# Altium project resistance_box_PCB.PrjPcb
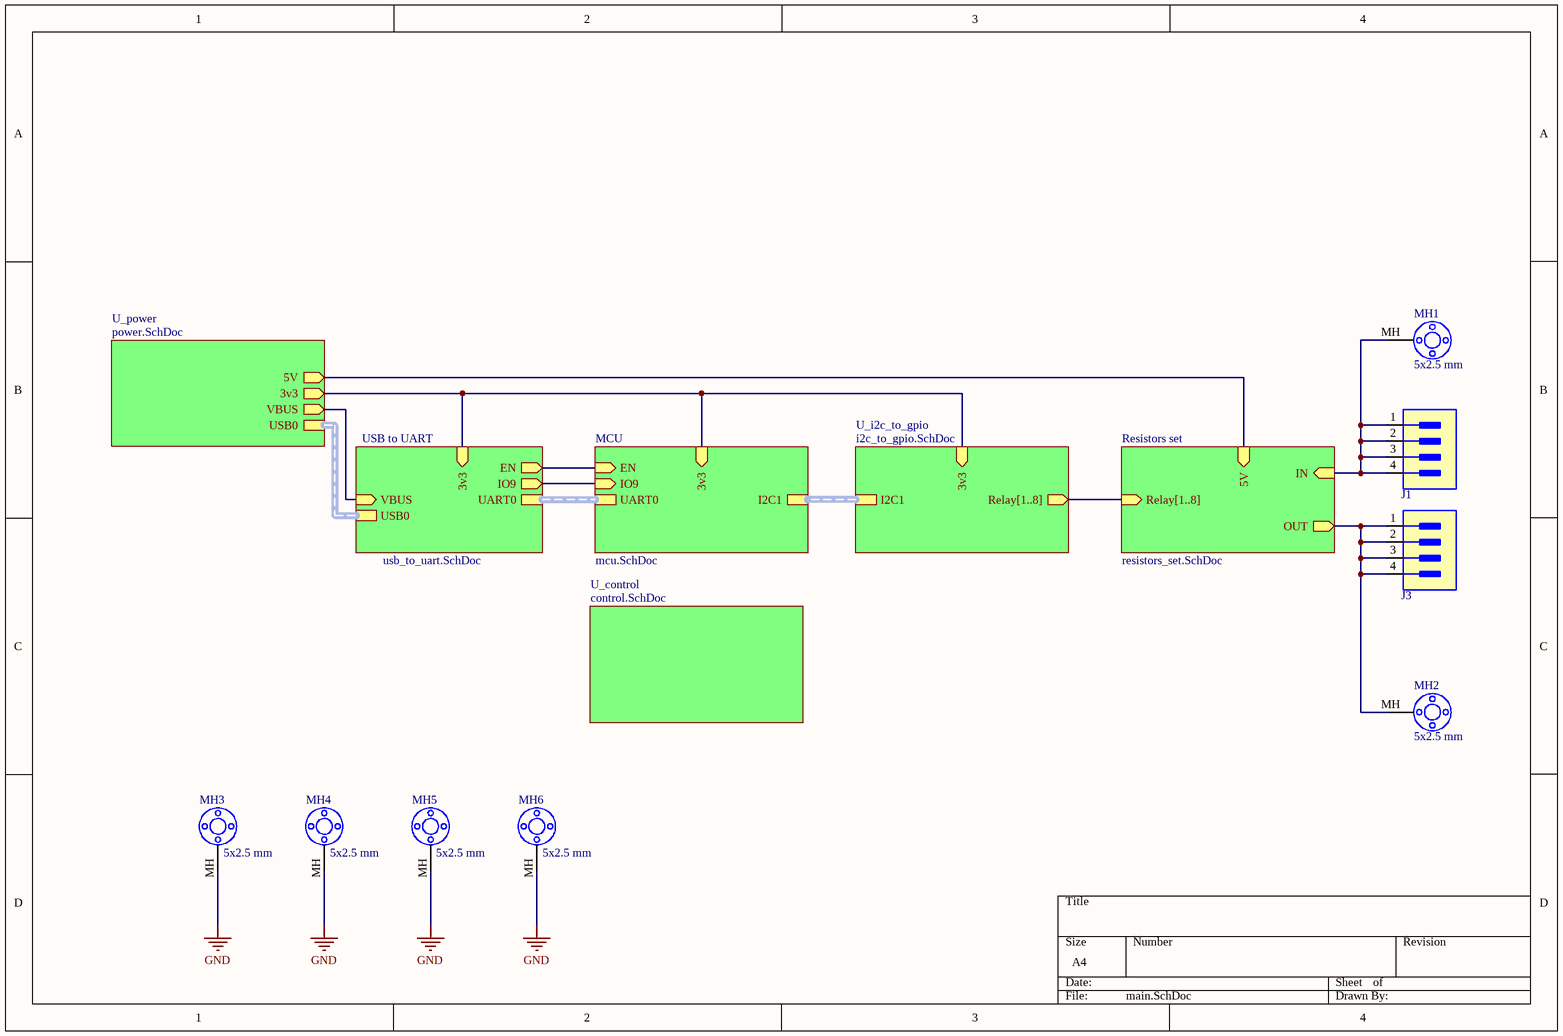
[diagram p0: main.SchDoc]
7 sheets, 83 parts. Net scope: hierarchical (ports join the sheet entries above them; power ports are global).
Board file: resistance_box_PCB.PcbDoc
Sheets:
  main.SchDoc
    Resistors set = resistors_set.SchDoc
    MCU = mcu.SchDoc
    U_power = power.SchDoc
    USB to UART = usb_to_uart.SchDoc
    U_i2c_to_gpio = i2c_to_gpio.SchDoc
    U_control = control.SchDoc

## Sheet main.SchDoc
size A4; SheetNumber: 1; SheetTotal: 7

### Parts
J1  PM254-2-02-Z-8.5  [254-2-2-Fem]  (value not drawn)
J3  PM254-2-02-Z-8.5  [254-2-2-Fem]  (value not drawn)
MH1  5x2.5 mm  [5x2m7_plated_hole]
MH2  5x2.5 mm  [5x2m7_plated_hole]
MH3  5x2.5 mm  [5x2m7_plated_hole]
MH4  5x2.5 mm  [5x2m7_plated_hole]
MH5  5x2.5 mm  [5x2m7_plated_hole]
MH6  5x2.5 mm  [5x2m7_plated_hole]

### Sub-sheets
MCU = mcu.SchDoc: 3v3 (in), I2C1, UART0, EN (in), IO9 (in)
Resistors set = resistors_set.SchDoc: IN (in), OUT (out), 5V (in), Relay[1..8] (in)
U_control = control.SchDoc: no entries
U_i2c_to_gpio = i2c_to_gpio.SchDoc: I2C1 (harness I2C), 3v3 (in), Relay[1..8] (out)
U_power = power.SchDoc: 3v3 (out), 5V (out), VBUS (out), USB0 (harness USB)
USB to UART = usb_to_uart.SchDoc: UART0 (harness UART), 3v3 (in), EN (out), IO9 (out), VBUS (in), USB0

### Nets
3v3: sheet MCU/3v3, sheet U_power/3v3, sheet USB to UART/3v3, sheet U_i2c_to_gpio/3v3
5v: sheet Resistors set/5V, sheet U_power/5V
GND: MH3.MH MH4.MH MH5.MH MH6.MH
EN: sheet MCU/EN, sheet USB to UART/EN
IO9: sheet MCU/IO9, sheet USB to UART/IO9
NetCR2_1: sheet U_power/VBUS, sheet USB to UART/VBUS
NetJ1_1: J1.1 J1.2 J1.3 J1.4 MH1.MH ; sheet Resistors set/IN
NetJ3_1: J3.1 J3.2 J3.3 J3.4 MH2.MH ; sheet Resistors set/OUT

### Buses and harness runs
bus sheet Resistors set/Relay[1..8] = sheet U_i2c_to_gpio/Relay[1..8]
harness sheet MCU/I2C1 = sheet U_i2c_to_gpio/I2C1
harness sheet MCU/UART0 = sheet USB to UART/UART0
harness sheet U_power/USB0 = sheet USB to UART/USB0

### Library data of the parts
J1 J3 = PM254-2-02-Z-8.5: 2.54mm 2.54mm 3A Copper Alloy 4P -40℃~+105℃ 260℃@5S Straight 2x2P 8.5mm Top Square Holes Plugin,P=2.54mm Female Headers ROHS; Manufacturer: HCTL; Item: Header 2.54 2x2 Female; Supplier 1: LCSC; Supplier Part Number 1: C2897403; Case: Female; Part Number: PM254-2-02-Z-8.5; HelpURL: https://datasheet.lcsc.com/lcsc/2306091005_HCTL-PM254-2-02-Z-8-5_C2897403.pdf?_gl=1*j2h43v*_ga*MTA1Mzg1NzAxMC4xNzEyNDA1NTIz*_ga_98M84MKSZH*MTcxNzc5MzMyMy44LjEuMTcxNzc5NDE5OC40My4wLjA.; Category: Headers & Wire Housings
MH1-MH6 = none: Plated hole 5x2.5 mm; Part Number: none; Item: 5x2.5 mm; Supplier: none; Case: none; Manufacturer: none; HelpURL: none

## Sheet resistors_set.SchDoc
size A4; SheetNumber: 2; SheetTotal: 6
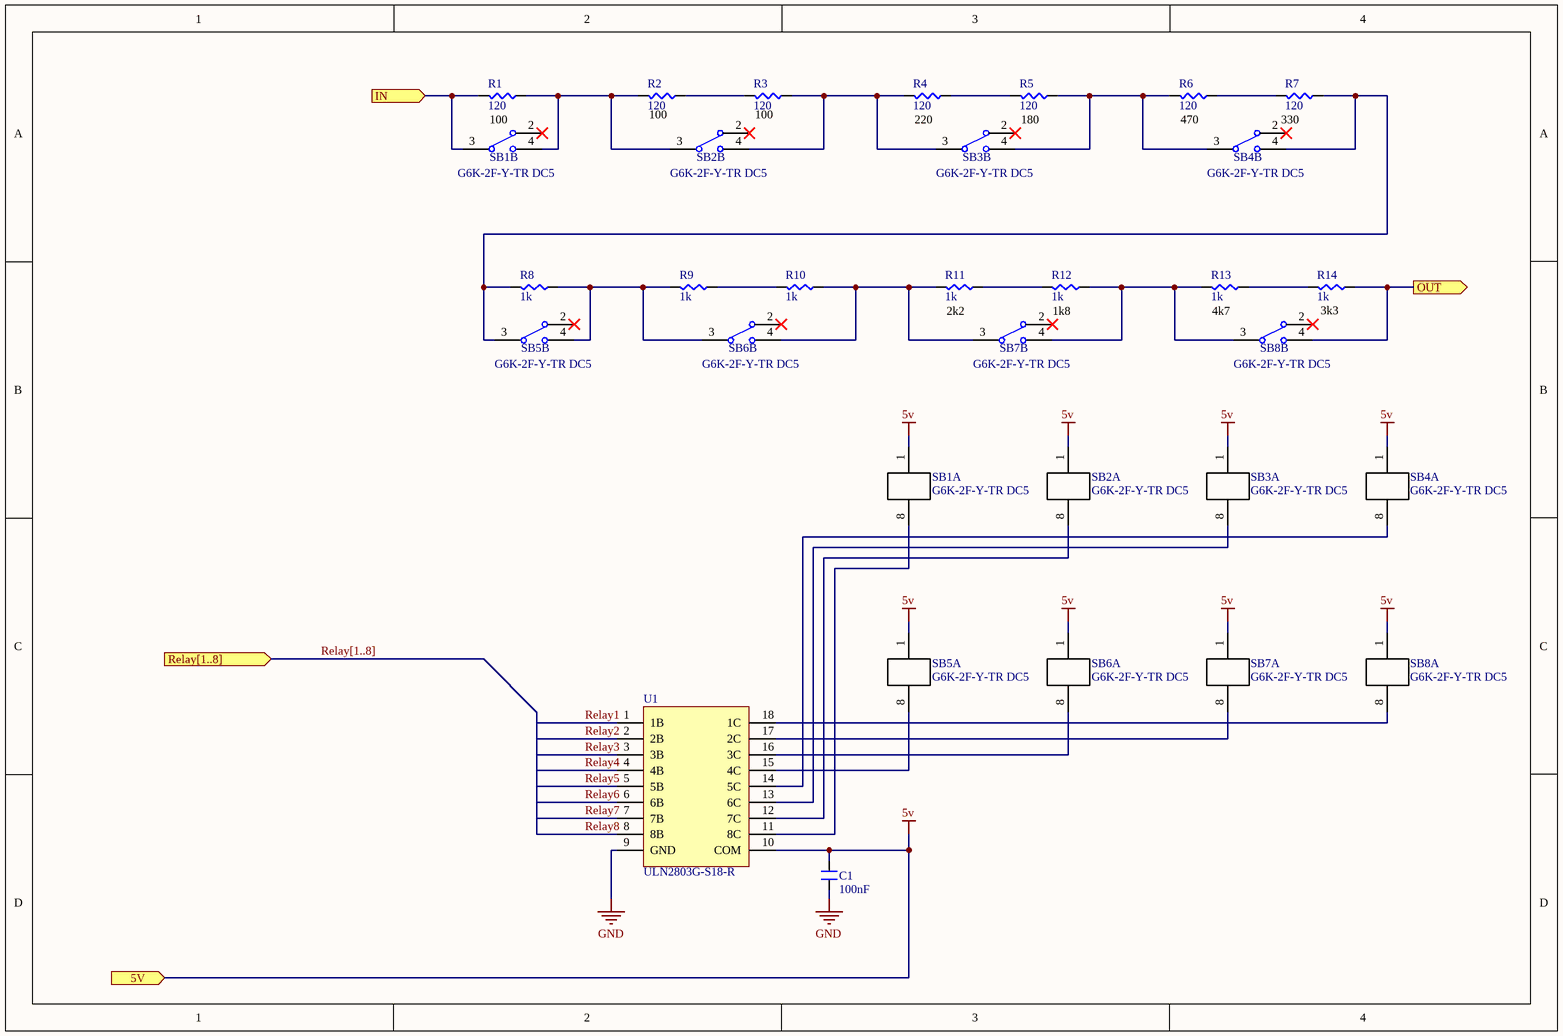
[diagram p1: resistors_set.SchDoc]

### Parts
C1  100nF  [CAP0603]
R1  120  [RES1206]
R2  120  [RES1206]
R3  120  [RES1206]
R4  120  [RES1206]
R5  120  [RES1206]
R6  120  [RES1206]
R7  120  [RES1206]
R8  1k  [RES1206]
R9  1k  [RES1206]
R10  1k  [RES1206]
R11  1k  [RES1206]
R12  1k  [RES1206]
R13  1k  [RES1206]
R14  1k  [RES1206]
SB1  G6K-2F-Y-TR DC5  [Omron_G6K-2F-Y]  (parts A,B of 3)
SB2  G6K-2F-Y-TR DC5  [Omron_G6K-2F-Y]  (parts A,B of 3)
SB3  G6K-2F-Y-TR DC5  [Omron_G6K-2F-Y]  (parts A,B of 3)
SB4  G6K-2F-Y-TR DC5  [Omron_G6K-2F-Y]  (parts A,B of 3)
SB5  G6K-2F-Y-TR DC5  [Omron_G6K-2F-Y]  (parts A,B of 3)
SB6  G6K-2F-Y-TR DC5  [Omron_G6K-2F-Y]  (parts A,B of 3)
SB7  G6K-2F-Y-TR DC5  [Omron_G6K-2F-Y]  (parts A,B of 3)
SB8  G6K-2F-Y-TR DC5  [Omron_G6K-2F-Y]  (parts A,B of 3)
U1  ULN2803G-S18-R  [SOIC-18-wide]

### Ports
5V (in), IN (in), OUT (out), Relay[1..8] (in)

### Nets
5v: C1.2 SB1.1 SB2.1 SB3.1 SB4.1 SB5.1 SB6.1 SB7.1 SB8.1 U1.10(COM) ; port 5V
GND: C1.1 U1.9(GND)
Relay1: U1.1(1B)
Relay2: U1.2(2B)
Relay3: U1.3(3B)
Relay4: U1.4(4B)
Relay5: U1.5(5B)
Relay6: U1.6(6B)
Relay7: U1.7(7B)
Relay8: U1.8(8B)
NetJ1_1: R1.1 SB1.3 ; port IN
NetJ3_1: R14.2 SB8.4 ; port OUT
NetR1_2: R1.2 R2.1 SB1.4 SB2.3
NetR2_2: R2.2 R3.1
NetR3_2: R3.2 R4.1 SB2.4 SB3.3
NetR4_2: R4.2 R5.1
NetR5_2: R5.2 R6.1 SB3.4 SB4.3
NetR6_2: R6.2 R7.1
NetR7_2: R7.2 R8.1 SB4.4 SB5.3
NetR8_2: R8.2 R9.1 SB5.4 SB6.3
NetR9_2: R9.2 R10.1
NetR10_2: R10.2 R11.1 SB6.4 SB7.3
NetR11_2: R11.2 R12.1
NetR12_2: R12.2 R13.1 SB7.4 SB8.3
NetR13_2: R13.2 R14.1
NetSB1_8: SB1.8 U1.11(8C)
NetSB2_8: SB2.8 U1.12(7C)
NetSB3_8: SB3.8 U1.13(6C)
NetSB4_8: SB4.8 U1.14(5C)
NetSB5_8: SB5.8 U1.15(4C)
NetSB6_8: SB6.8 U1.16(3C)
NetSB7_8: SB7.8 U1.17(2C)
NetSB8_8: SB8.8 U1.18(1C)

Not connected (* = marked no-connect by the designer): SB1 2*; SB2 2*; SB3 2*; SB4 2*; SB5 2*; SB6 2*; SB7 2*; SB8 2*

### Buses and harness runs
bus Relay[1..8] = port Relay[1..8]

### Notes on the sheet
- (near SB1) 100
- (near R2) 100
- (near R3) 100
- 220
- (near R5) 180
- (near R6) 470
- 330
- (near R11) 2k2
- 1k8
- 4k7
- (near R14) 3k3

### Library data of the parts
C1 = GCM188R71H104KA57J: Tolerance ±10% / Rated Voltage 50Vdc / Temperature 0±30ppm/℃; Manufacturer: Arrow Electronics; Item: 100nF 50V  ±10%; Vdc: 50V; Part Number: GCM188R71H104KA57J; Supplier 1: Mouser; Supplier Part Number 1: 81-GCM188R71H104KA7J; Case: 0603; Tolerance: 10%; Value: 100nF; HelpURL: http://www.farnell.com/datasheets/4360.pdf?src-supplier=Element14; Category: Multilayer Ceramic Capacitors - SMD/SMT
R1-R7 = CR1206-FX-1200ELF: Tolerance ±1% / Power (Watts) 0.25W, 1/4W / Temperature Coefficient ±100ppm/°C; Manufacturer: Bourns; Item: 120 ±1% 0.25W; Part Number: CR1206-FX-1200ELF; Supplier 1: Mouser; Supplier Part Number 1: 652-CR1206FX-1200ELF; Case: 1206; Tolerance: 1%; Value: 120; HelpURL: https://eu.mouser.com/datasheet/2/54/cr-1858361.pdf; Category: Thin Film Resistors - SMD
R8-R14 = CRT1206-FZ-1001ELF: Tolerance ±1% / Power (Watts) 0.1W, 1/10W / Temperature Coefficient ±50ppm/°C; Manufacturer: Bourns; Item: 1k ±1% 0.25W; Part Number: CRT1206-FZ-1001ELF; Supplier 1: Mouser; Supplier Part Number 1: 652-CRT1206FZ1001ELF; Case: 1206; Tolerance: 1%; Value: 1k; HelpURL: https://eu.mouser.com/datasheet/2/54/CRT-1649066.pdf; Category: Thin Film Resistors - SMD
SB1-SB8 = G6K-2F-Y-TR DC5: 1A 5V DPDT (2 Form C) SMD,6.5x10mm Signal Relays ROHS; Manufacturer: Omron Electronics; Part Number: G6K-2F-Y-TR DC5; Item: G6K-2F-Y-TR DC5; Supplier: LCSC; Supplier Part Number 1: C47190; Mechanical Life: N/A; Switch Function: DPDT (2 Form C); Vdss: 5V; Case: SMD,6.5x10mm; HelpURL: https://www.lcsc.com/datasheet/lcsc_datasheet_2211282300_Omron-Electronics-G6K-2F-Y-TR-DC5_C47190.pdf; Category: Relays/Signal Relays
U1 = ULN2803G-S18-R: SOP-18 Darlington Transistor Arrays ROHS; Manufacturer: UTC(Unisonic Tech); Channel: NPN; Vds: 50B; Id: 500mA; Part Number: ULN2803G-S18-R; Item: ULN2803; Supplier 1: LCSC; Supplier Part Number 1: C33924; Case: SOP-18; HelpURL: https://www.lcsc.com/datasheet/lcsc_datasheet_1810241824_UTC-Unisonic-Tech-ULN2803G-S18-R_C33924.pdf; Category: Transistors/Thyristors/Darlington Transistor Arrays

## Sheet mcu.SchDoc
size A4; SheetNumber: 3; SheetTotal: 5
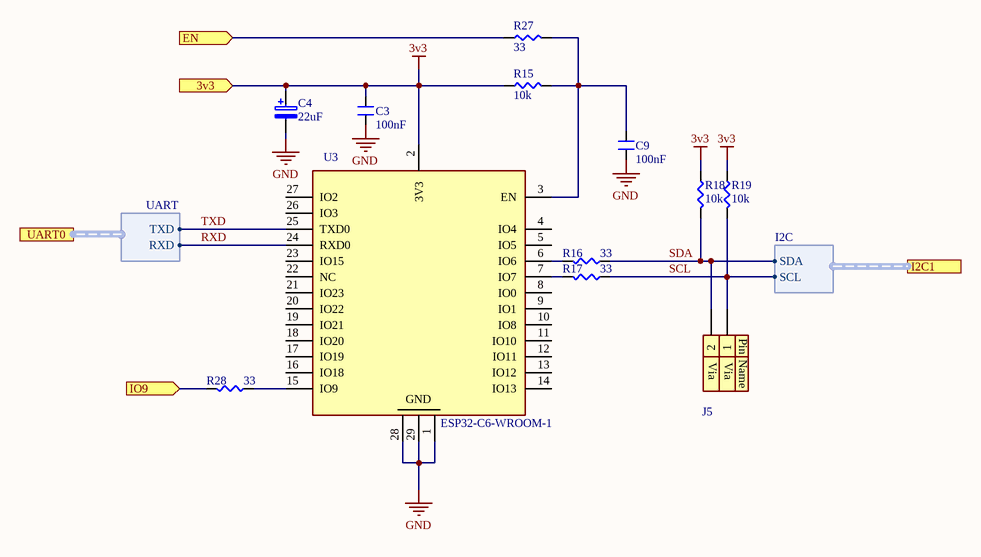
[diagram p2: mcu.SchDoc]

### Parts
C3  100nF  [CAP0603]
C4  22uF  [CAP TANT B]
C9  100nF  [CAP0603]
J5  M20-9990246  [FP-M20-9990246-MFG]  (value not drawn)
R15  10k  [RES0603]
R16  33  [RES0603]
R17  33  [RES0603]
R18  10k  [RES0603]
R19  10k  [RES0603]
R27  33  [RES0603]
R28  33  [RES0603]
U3  ESP32-C6-WROOM-1  [ESP32-C6-WROOM-1]

### Ports
3v3 (in), EN (in), I2C1 (harness I2C), IO9 (in), UART0 (harness UART)

### Harnesses
I2C: SDA, SCL
UART: TXD, RXD

### Nets
3v3: C3.2 C4.1 R15.2 R18.2 R19.2 U3.2(3V3) ; port 3v3
GND: C3.1 C4.2 C9.1 U3.1(GND) U3.28(GND) U3.29(GND)
EN: R27.2 ; port EN
IO9: R28.1 ; port IO9
RXD: U3.24(RXD0) ; port UART0.RXD
SCL: J5.1 R17.2 R19.1 ; port I2C1.SCL
SDA: J5.2 R16.2 R18.1 ; port I2C1.SDA
TXD: U3.25(TXD0) ; port UART0.TXD
NetC9_2: C9.2 R15.1 R27.1 U3.3(EN)
NetR16_1: R16.1 U3.6(IO6)
NetR17_1: R17.1 U3.7(IO7)
NetR28_2: R28.2 U3.15(IO9)

Not connected (* = marked no-connect by the designer): U3 4(IO4) 5(IO5) 8(IO0) 9(IO1) 10(IO8) 11(IO10) 12(IO11) 13(IO12) 14(IO13) 16(IO18) 17(IO19) 18(IO20) 19(IO21) 20(IO22) 21(IO23) 22(NC) 23(IO15) 26(IO3) 27(IO2)

### Notes on the sheet
- (in symbol M20-9990246) Pin; Via; Name

### Library data of the parts
C3 C9 = GCM188R71H104KA57J: as C1 on sheet resistors_set; Part Number: GCM188R71H104KA57J; Supplier 1: Mouser; Supplier Part Number 1: 81-GCM188R71H104KA7J; Case: 0603; Tolerance: 10%; Value: 100nF; HelpURL: http://www.farnell.com/datasheets/4360.pdf?src-supplier=Element14; Category: Multilayer Ceramic Capacitors - SMD/SMT
C4 = TAJB226K016RNJ: Tolerance ±10% / Type Molded / ESR (Equivalent Series Resistance) 2,3Ohm / Operating Temperature -55°C ~ 125°C; Manufacturer: KYOCERA AVX; Item: 22uF 16V ±10%; Vdc: 16V; Part Number: TAJB226K016RNJ; Supplier 1: Mouser; Supplier Part Number 1: 581-TAJB226K016; Case: Manufacturer Size Code B; Tolerance: 10%; Value: 22uF; HelpURL: https://eu.mouser.com/datasheet/2/40/TAJ-3165264.pdf; Category: Tantalum Capacitors - Solid SMD
J5 = M20-9990246: CONN HEADER VERT 2POS 2.54MM; Manufacturer: Harwin; Conn Gender: Male; Supplier 1: Digi-Key; Supplier Part Number 1: 952-2262-ND; Case: Male; Part Number: M20-9990246; Item: CMP-15831-000009-1; HelpURL: https://cdn.harwin.com/pdfs/M20-999.pdf?src-supplier=Element14
R15 R18 R19 = CR0603-FX-1002ELF: Tolerance ±1% / Power (Watts) 0.1W, 1/10W / Temperature Coefficient ±100ppm/°C; Manufacturer: Bourns; Item: 10k  ±1% 0.1W; Part Number: CR0603-FX-1002ELF; Supplier 1: Mouser; Supplier Part Number 1: 652-CR0603FX-1002ELF; Case: 0603; Tolerance: 1%; Value: 10k; HelpURL: https://eu.mouser.com/datasheet/2/54/cr-1858361.pdf; Category: Thin Film Resistors - SMD
R16 R17 R27 R28 = CR0603FX-33R0ELF: Tolerance ±1% / Power (Watts) 0.1W, 1/10W / Temperature Coefficient ±100ppm/°C; Manufacturer: Bourns; Item: 33  ±1% 0.1W; Part Number: CR0603FX-33R0ELF; Supplier 1: Mouser; Supplier Part Number 1: 652-CR0603FX-33R0ELF; Case: 0603; Tolerance: 1%; Value: 33; HelpURL: https://eu.mouser.com/datasheet/2/54/crxxxxx-1858361.pdf; Category: Thin Film Resistors - SMD
U3 = ESP32-C6-WROOM-1: ESP32-C6 module, Wi-Fi 6 in 2.4 GHz band, Bluetooth 5, Zigbee 3.0 and Thread. ESP34-WROOM Compatible; Manufacturer: Espressif Systems; Interfaces: GPIO, SPI, UART, I2C, I2S, RMT; Vdss: 3.3V; Part Number: ESP32-C6-WROOM-1; Item: ESP32-C6-WROOM-1; Supplier 1: Aliexpress; Supplier Part Number 1: ESP32-C6-WROOM-1; Case: Development Boards; HelpURL: https://www.espressif.com/sites/default/files/documentation/esp32-c6-wroom-1_wroom-1u_datasheet_en.pdf; Category: Multiprotocol Modules

## Sheet power.SchDoc
size A4; SheetNumber: 4; SheetTotal: 5
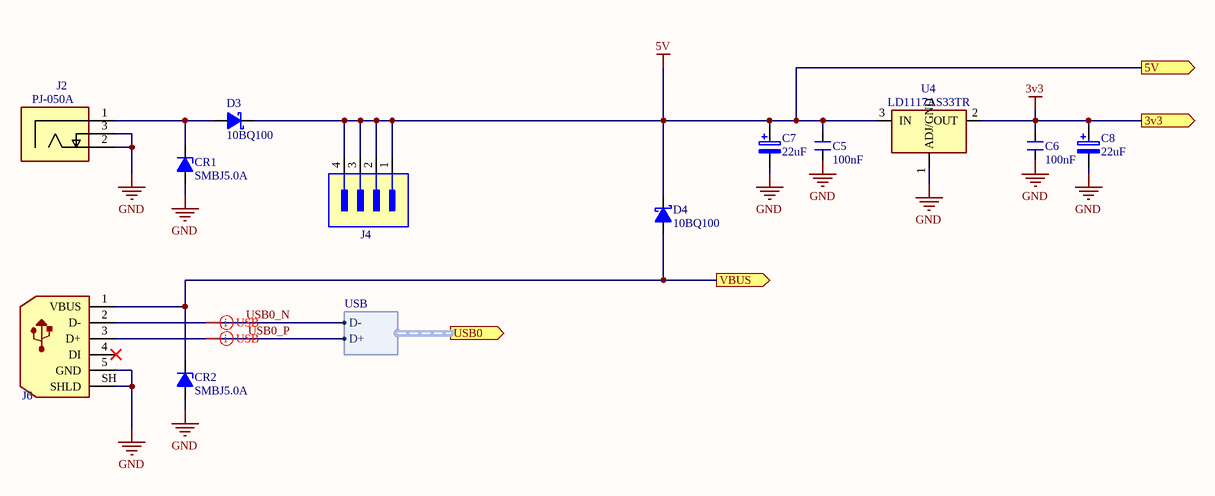
[diagram p3: power.SchDoc]

### Parts
C5  100nF  [CAP0603]
C6  100nF  [CAP0603]
C7  22uF  [CAP TANT B]
C8  22uF  [CAP TANT B]
CR1  SMBJ5.0A  [DO-214AA-2_SMB]
CR2  SMBJ5.0A  [DO-214AA-2_SMB]
D3  10BQ100  [DO-214AA-2_SMB]
D4  10BQ100  [DO-214AA-2_SMB]
J2  PJ-050A  [CUI_PJ050A]
J4  PM254-2-02-Z-8.5  [254-2-2-Fem]  (value not drawn)
J6  micro-USB female  [GCT_USB_Micro_B]  (value not drawn)
U4  LD1117AS33TR  [SOT-223]

### Ports
3v3 (out), 5V (out), USB0 (out, harness USB), VBUS (out)

### Harnesses
USB: D-, D+

### Nets
3v3: C6.2 C8.1 U4.2(OUT) ; port 3v3
5v: C5.2 C7.1 D3.1(C) D4.1(C) J4.1 J4.2 J4.3 J4.4 U4.3(IN) ; port 5V
GND: C5.1 C6.1 C7.2 C8.2 CR1.2(A) CR2.2(A) J2.2 J2.3 J6.5(GND) J6.SH(SHLD) U4.1(ADJ/GND)
USB0_N: J6.2(D-) ; port USB0.D-
USB0_P: J6.3(D+) ; port USB0.D+
NetCR1_1: CR1.1(C) D3.2(A) J2.1
NetCR2_1: CR2.1(C) D4.2(A) J6.1(VBUS) ; port VBUS

Not connected (* = marked no-connect by the designer): J6 4(DI)*

### Layout directives
differential pair; differential pair class USB: USB0_N, USB0_P

### Library data of the parts
C5 C6 = GCM188R71H104KA57J: as C1 on sheet resistors_set; Part Number: GCM188R71H104KA57J; Supplier 1: Mouser; Supplier Part Number 1: 81-GCM188R71H104KA7J; Case: 0603; Tolerance: 10%; Value: 100nF; HelpURL: http://www.farnell.com/datasheets/4360.pdf?src-supplier=Element14; Category: Multilayer Ceramic Capacitors - SMD/SMT
C7 C8 = TAJB226K016RNJ: as C4 on sheet mcu; Part Number: TAJB226K016RNJ; Supplier 1: Mouser; Supplier Part Number 1: 581-TAJB226K016; Case: Manufacturer Size Code B; Tolerance: 10%; Value: 22uF; HelpURL: https://eu.mouser.com/datasheet/2/40/TAJ-3165264.pdf; Category: Tantalum Capacitors - Solid SMD
CR1 CR2 = SMBJ5.0A: ESD Suppressors / TVS Diodes 600W 5V Unidirect; Manufacturer: Bourns; Item: SMBJ5.0A; Part Number: SMBJ5.0A; Supplier 1: Mouser; Vdss: 5V; Case: DO-214AA-2; HelpURL: https://eu.mouser.com/datasheet/2/54/smbj-778392.pdf; Category: ESD Suppressors / TVS Diodes
D3 D4 = 10BQ100: Schottky Diodes & Rectifiers 1A 100V Single Die Schottky Rectifier; Manufacturer: Hottech; Type: Diode Schottky; Id: 1А; Part Number: 10BQ100; Item: 10BQ100; Supplier 1: ChipDip; Supplier Part Number 1: 9000970121; Vdss: 100V; Case: DO-214AA-2; HelpURL: https://static.chipdip.ru/lib/751/DOC015751074.pdf; Category: Schottky Diodes & Rectifiers
J2 = PJ-050A: DC Power Connectors Power Jacks Right Angle; Manufacturer Part Number: MJ-2506N; Manufacturer: CUI Devices; Supplier 1: Mouser; Supplier Part Number 1: 490-PJ-050A; Part Number: PJ-050A; Item: PJ-050A; Case: Female; HelpURL: https://eu.mouser.com/datasheet/2/670/pj_050a-1778816.pdf; Category: DC Power Connectors
J4 = PM254-2-02-Z-8.5: as J1 on sheet main; Supplier 1: LCSC; Supplier Part Number 1: C2897403; Case: Female; Part Number: PM254-2-02-Z-8.5; HelpURL: https://datasheet.lcsc.com/lcsc/2306091005_HCTL-PM254-2-02-Z-8-5_C2897403.pdf?_gl=1*j2h43v*_ga*MTA1Mzg1NzAxMC4xNzEyNDA1NTIz*_ga_98M84MKSZH*MTcxNzc5MzMyMy44LjEuMTcxNzc5NDE5OC40My4wLjA.; Category: Headers & Wire Housings
J6 = 640-USB3076-30-A: USB Connectors Micro B Skt, Bottom-SMT, R/A, 30u, No Peg, W/shell stake, No MEF,T&R; Manufacturer: GCT; Item: USB-Micro; Part Number: 640-USB3076-30-A; Supplier 1: Mouser; Case: Female; HelpURL: https://eu.mouser.com/datasheet/2/837/USB3076-2888220.pdf; Category: USB Connectors
U4 = LD1117AS33TR: Linear Voltage Regulators 3.3V 1A Positive; Manufacturer: STMicroelectronics; Output Voltage: 3,3; Input Voltage, Max: 10; Part Number: LD1117AS33TR; Item: LD1117A; Supplier 1: Chipdip; Supplier Part Number 1: LD1117AS33TR; Case: SOT-223; HelpURL: https://static.chipdip.ru/lib/918/DOC012918569.pdf; Category: Linear Voltage Regulators; Output Current: 1 A

## Sheet usb_to_uart.SchDoc
size A4; SheetNumber: 5; SheetTotal: 6
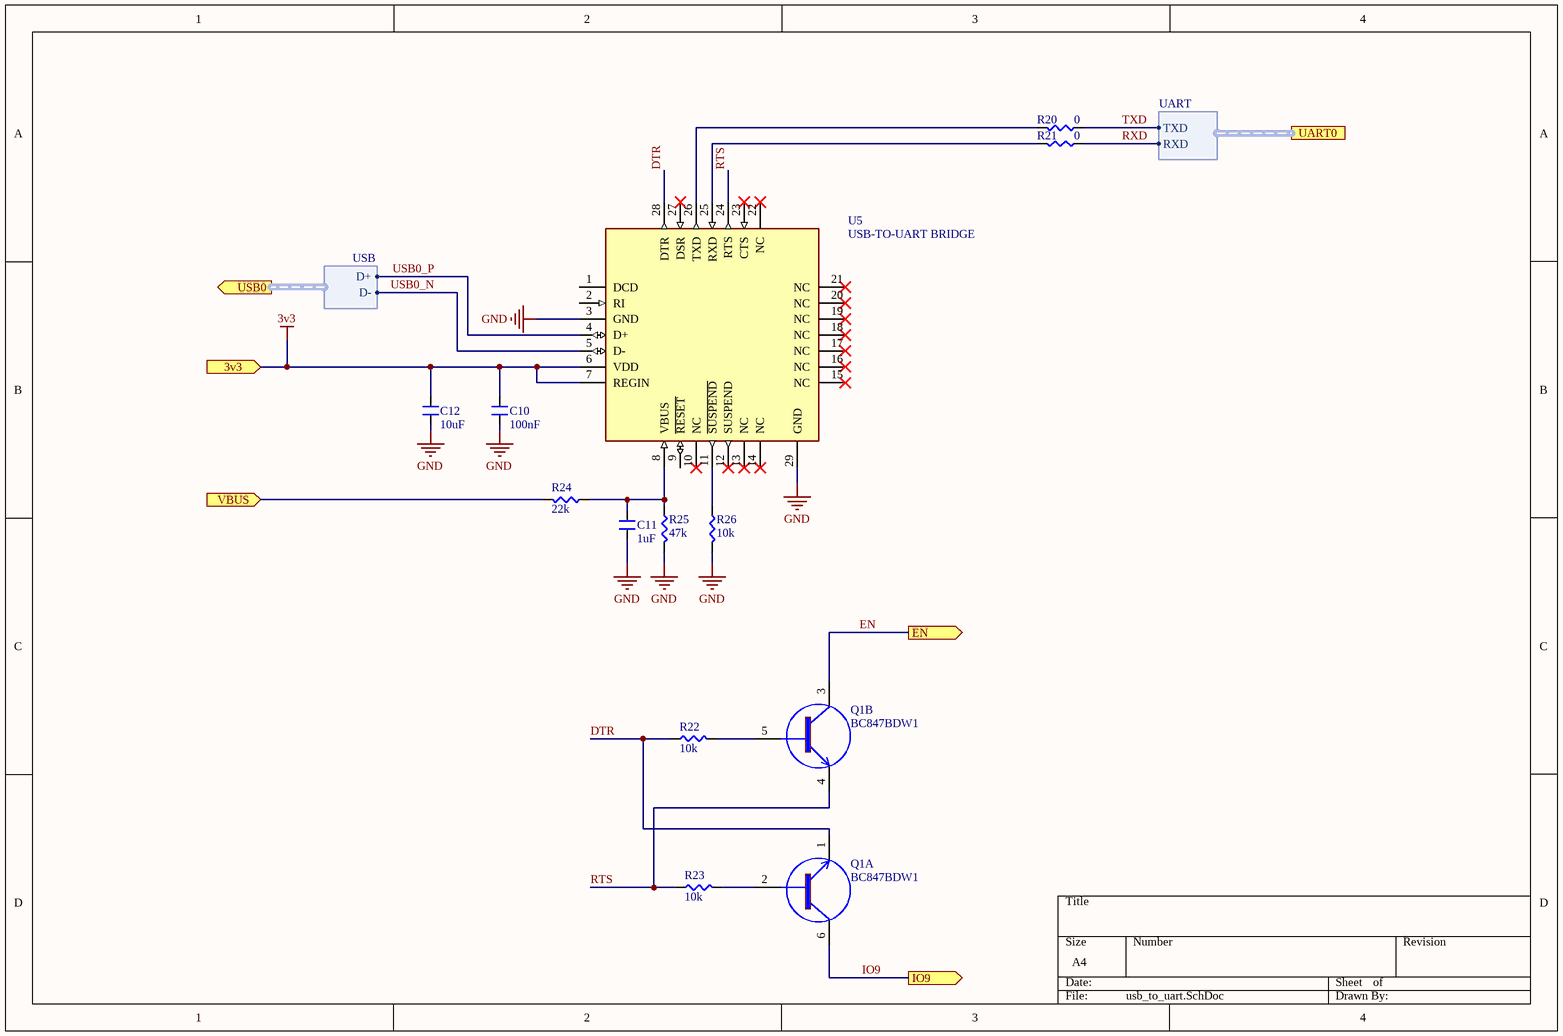
[diagram p4: usb_to_uart.SchDoc]

### Parts
C10  100nF  [CAP0603]
C11  1uF  [CAP1206_38MIL]
C12  10uF  [CAP1206_63MIL]
Q1  BC847BDW1  [SOT-363]  (parts A,B of 2)
R20  0  [RES0603]
R21  0  [RES0603]
R22  10k  [RES0603]
R23  10k  [RES0603]
R24  22k  [RES0603]
R25  47k  [RES0603]
R26  10k  [RES0603]
U5  USB-TO-UART BRIDGE  [QFN50P480X480X80_HS-29N]

### Ports
3v3 (in), EN (out), IO9 (out), UART0 (harness UART), USB0 (out, harness USB), VBUS (in)

### Harnesses
UART: TXD, RXD
USB: D-, D+

### Nets
3v3: C10.2 C12.2 U5.6(VDD) U5.7(REGIN) ; port 3v3
GND: C10.1 C11.1 C12.1 R25.1 R26.1 U5.3(GND) U5.29(GND)
DTR: Q1.1(E2) R22.2 U5.28(DTR)
EN: Q1.3(C2) ; port EN
IO9: Q1.6(C2) ; port IO9
RTS: Q1.4(E2) R23.2 U5.24(RTS)
RXD: R21.2 ; port UART0.RXD
TXD: R20.2 ; port UART0.TXD
USB0_N: U5.5(D-) ; port USB0.D-
USB0_P: U5.4(D+) ; port USB0.D+
NetC11_2: C11.2 R24.2 R25.2 U5.8(VBUS)
NetCR2_1: R24.1 ; port VBUS
NetQ1_2: Q1.2(B2) R23.1
NetQ1_5: Q1.5(B2) R22.1
NetR20_1: R20.1 U5.26(TXD)
NetR21_1: R21.1 U5.25(RXD)
NetR26_2: R26.2 U5.11(~{SUSPEND})

Not connected (* = marked no-connect by the designer): U5 1(DCD) 2(RI) 9(~{RESET}) 10(NC)* 12(SUSPEND)* 13(NC)* 14(NC)* 15(NC)* 16(NC)* 17(NC)* 18(NC)* 19(NC)* 20(NC)* 21(NC)* 22(NC)* 23(CTS)* 27(DSR)*

### Library data of the parts
C10 = GCM188R71H104KA57J: as C1 on sheet resistors_set; Part Number: GCM188R71H104KA57J; Supplier 1: Mouser; Supplier Part Number 1: 81-GCM188R71H104KA7J; Case: 0603; Tolerance: 10%; Value: 100nF; HelpURL: http://www.farnell.com/datasheets/4360.pdf?src-supplier=Element14; Category: Multilayer Ceramic Capacitors - SMD/SMT
C11 = C1206X105K5RECAUTO: Tolerance ±10% / Rated Voltage 50Vdc / Dielectric:  X7R; Manufacturer: KEMET; Item: 1uF 50V ±10%; Vdc: 50V; Tolerance: 0,1; Part Number: C1206X105K5RECAUTO; Supplier 1: Mouser; Case: 1206; Value: 1uF; HelpURL: https://eu.mouser.com/datasheet/2/212/1/KEM_C1090_X7R_ESD-1103328.pdf
C12 = GRT31CR61H106ME01L: Tolerance ±20% / Voltage - Rated 50V; Manufacturer: Murata; Item: 10uF 50V ±20%; Tolerance: 0,2; Part Number: GRT31CR61H106ME01L; Supplier 1: Mouser; Supplier Part Number 1: 81-GRT31CR61H106ME1L; Case: 1206; Vdc: 50V; Value: 10uF; HelpURL: https://eu.mouser.com/datasheet/2/281/GRT31CR61H106ME01-01-1065064.pdf; Category: Multilayer Ceramic Capacitors - SMD/SMT
Q1 = BC847BDW1: 45V 380mW 200@2mA,5V 100mA NPN SOT-363 Bipolar Transistors - BJT ROHS; Manufacturer: onsemi; Vds: 45B; Part Number: BC847BDW1; Item: BC847BDW1; Supplier 1: LCSC; Supplier Part Number 1: C513269; Channel: NPN; Case: SOT-363; HelpURL: https://www.lcsc.com/datasheet/lcsc_datasheet_2004241034_onsemi-BC847BDW1T3G_C513269.pdf; Category: Transistors/Thyristors/Darlington Transistor Arrays
R20 R21 = AF0603JR-070RL: Tolerance ±1% / Power (Watts) 0.1W, 1/10W / Temperature Coefficient ±100ppm/°C; Manufacturer: YAGEO; Item: 0 ±1% 0.1W; Part Number: AF0603JR-070RL; Supplier 1: Mouser; Supplier Part Number 1: 603-AF0603JR-070RL; Case: 0603; Tolerance: 1%; Value: 0; HelpURL: https://eu.mouser.com/datasheet/2/447/PYu_AF_51_RoHS_L_8-3003045.pdf; Category: Thin Film Resistors - SMD
R22 R23 R26 = CR0603-FX-1002ELF: as R15 on sheet mcu; Part Number: CR0603-FX-1002ELF; Supplier 1: Mouser; Supplier Part Number 1: 652-CR0603FX-1002ELF; Case: 0603; Tolerance: 1%; Value: 10k; HelpURL: https://eu.mouser.com/datasheet/2/54/cr-1858361.pdf; Category: Thin Film Resistors - SMD
R24 = CR0603-FX-2202ELF: Tolerance ±1% / Power (Watts) 0.1W, 1/10W / Temperature Coefficient ±100ppm/°C; Manufacturer: Bourns; Item: 22k ±1% 0.1W; Part Number: CR0603-FX-2202ELF; Supplier 1: Mouser; Supplier Part Number 1: 652-CR0603FX-2202ELF; Case: 0603; Tolerance: 1%; Value: 22k; HelpURL: https://www.mouser.com/datasheet/2/54/cr-1858361.pdf; Category: Thin Film Resistors - SMD
R25 = ERJ-3EKF4702V: Tolerance ±1% / Power (Watts) 0.1W, 1/10W / Temperature Coefficient ±100ppm/°C; Manufacturer: Panasonic; Item: 47k ±1% 0.1W; Part Number: ERJ-3EKF4702V; Supplier 1: Mouser; Supplier Part Number 1: 667-ERJ-3EKF4702V; Case: 0603; Tolerance: 1%; Value: 47k; HelpURL: https://www.mouser.com/datasheet/2/315/AOA0000C304-1149620.pdf; Category: Thin Film Resistors - SMD
U5 = CP2102: Voltage - Supply 3V ~ 3.6V / Current - Supply 20mA / Standards USB 2.0; Manufacturer: Silicon Lab; Part Number: CP2102; Supplier 1: Digi-Key; Supplier Part Number 1: 336-1160-1-ND; Case: QFN-28; Item: CP2102; HelpURL: https://www.silabs.com/documents/public/errata/CP2102Berrata.pdf?src-supplier=Digi-Key; Category: USB to UART Interface IC

## Sheet i2c_to_gpio.SchDoc
size A4; SheetNumber: 6; SheetTotal: 6
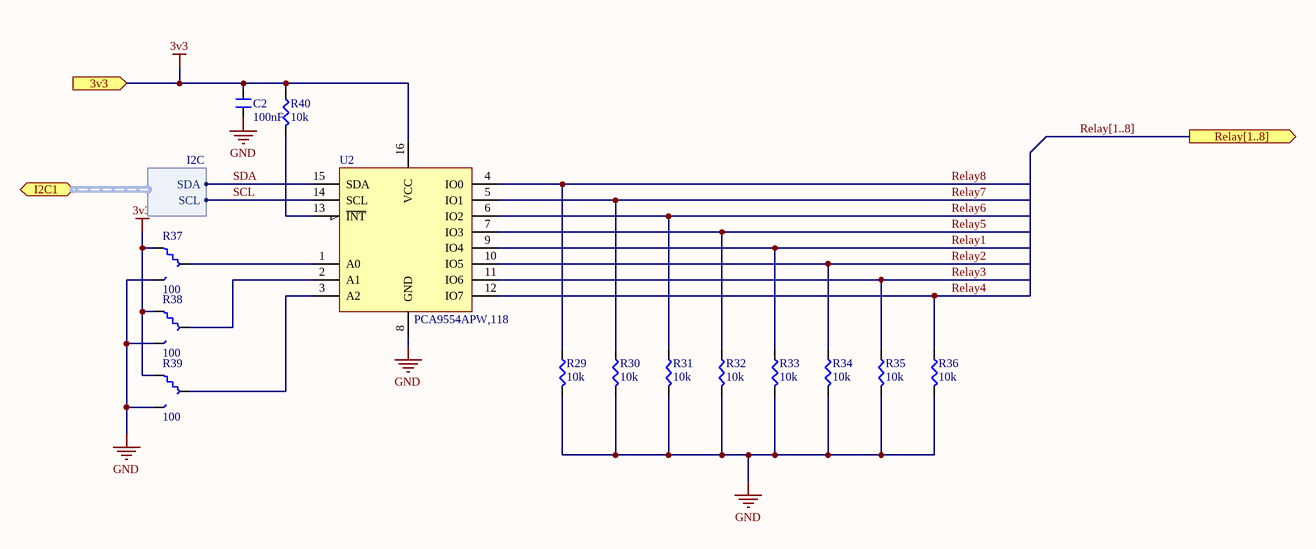
[diagram p5: i2c_to_gpio.SchDoc]

### Parts
C2  100nF  [CAP0603]
R29  10k  [RES0603]
R30  10k  [RES0603]
R31  10k  [RES0603]
R32  10k  [RES0603]
R33  10k  [RES0603]
R34  10k  [RES0603]
R35  10k  [RES0603]
R36  10k  [RES0603]
R37  100  [RES0603_CHANGE]
R38  100  [RES0603_CHANGE]
R39  100  [RES0603_CHANGE]
R40  10k  [RES0603]
U2  PCA9554APW,118  [TSSOP16]

### Ports
3v3 (in), I2C1 (bidir, harness I2C), Relay[1..8] (out)

### Harnesses
I2C: SDA, SCL

### Nets
3v3: C2.2 R37.1 R38.1 R39.1 R40.1 U2.16(VCC) ; port 3v3
GND: C2.1 R29.2 R30.2 R31.2 R32.2 R33.2 R34.2 R35.2 R36.2 R37.3 R38.3 R39.3 U2.8(GND)
Relay1: R33.1 U2.9(IO4)
Relay2: R34.1 U2.10(IO5)
Relay3: R35.1 U2.11(IO6)
Relay4: R36.1 U2.12(IO7)
Relay5: R32.1 U2.7(IO3)
Relay6: R31.1 U2.6(IO2)
Relay7: R30.1 U2.5(IO1)
Relay8: R29.1 U2.4(IO0)
SCL: U2.14(SCL) ; port I2C1.SCL
SDA: U2.15(SDA) ; port I2C1.SDA
NetR37_2: R37.2 U2.1(A0)
NetR38_2: R38.2 U2.2(A1)
NetR39_2: R39.2 U2.3(A2)
NetR40_2: R40.2 U2.13(~{INT})

### Buses and harness runs
bus Relay[1..8] = port Relay[1..8]

### Library data of the parts
C2 = GCM188R71H104KA57J: as C1 on sheet resistors_set; Part Number: GCM188R71H104KA57J; Supplier 1: Mouser; Supplier Part Number 1: 81-GCM188R71H104KA7J; Case: 0603; Tolerance: 10%; Value: 100nF; HelpURL: http://www.farnell.com/datasheets/4360.pdf?src-supplier=Element14; Category: Multilayer Ceramic Capacitors - SMD/SMT
R29-R36 R40 = CR0603-FX-1002ELF: as R15 on sheet mcu; Part Number: CR0603-FX-1002ELF; Supplier 1: Mouser; Supplier Part Number 1: 652-CR0603FX-1002ELF; Case: 0603; Tolerance: 1%; Value: 10k; HelpURL: https://eu.mouser.com/datasheet/2/54/cr-1858361.pdf; Category: Thin Film Resistors - SMD
R37-R39 = ERJ-3EKF9101V (Jump_RES): Tolerance ±1% / Power (Watts) 0.1W, 1/10W / Temperature Coefficient ±100ppm/°C; Manufacturer: Panasonic; Item: 100 ±1% 0.1W (Jump_RES); Part Number: ERJ-3EKF9101V (Jump_RES); Supplier 1: Mouser; Supplier Part Number 1: 667-ERJ-3EKF9101V; Case: 0603; Tolerance: 1%; Value: 100; HelpURL: https://eu.mouser.com/datasheet/2/315/AOA0000C304-1149620.pdf; Category: Thin Film Resistors - SMD
U2 = PCA9554APW,118: Interface - I/O Expander I2C I/O; Manufacturer: NXP; Part Number: PCA9554APW,118; Item: PCA9554APW,118; Supplier 1: Mouser; Supplier Part Number 1: 771-PCA9554APW-T; Case: 16-TSSOP; HelpURL: https://eu.mouser.com/datasheet/2/302/PCA9554_9554A-1127609.pdf; Category: I/O Expanders

## Sheet control.SchDoc
size A4; SheetNumber: 7; SheetTotal: 7
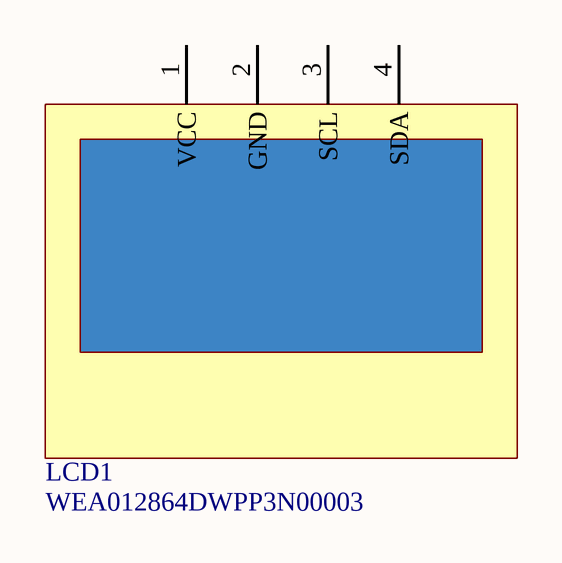
[diagram p6: control.SchDoc]

### Parts
LCD1  WEA012864DWPP3N00003  [WEA012864DWPP3N00003]

### Nets

Not connected (* = marked no-connect by the designer): LCD1 1(VCC) 2(GND) 3(SCL) 4(SDA)

### Library data of the parts
LCD1 = WEA012864DWPP3N00003: OLED 0.96" display, 128x64, white,  IC SSD1306BZ, I2C, 3v, -40...+80°С; Manufacturer: Winstar; Part Number: WEA012864DWPP3N00003; Item: WEA012864DWPP3N00003; Supplier 1: ChipDip; Supplier Part Number 1: 8001808254; Case: none; HelpURL: https://www.compel.ru/item-pdf/bf9bb7bf1ce7223b4efcb84e5467b96d/pn/winstar~wea012864dwpp3n00003.pdf; Category: OLED displays

## Nets that join several sheets
3v3: mcu (6 pins), power (C6.2 C8.1 U4.2), usb_to_uart (C10.2 C12.2 U5.6 U5.7), i2c_to_gpio (6 pins)
5v: resistors_set (10 pins), power (9 pins)
GND: main (MH3.MH MH4.MH MH5.MH MH6.MH), resistors_set (C1.1 U1.9), mcu (6 pins), power (11 pins), usb_to_uart (7 pins), i2c_to_gpio (13 pins)
EN: mcu (R27.2), usb_to_uart (Q1.3)
IO9: mcu (R28.1), usb_to_uart (Q1.6)
NetCR2_1: power (CR2.1 D4.2 J6.1), usb_to_uart (R24.1)
NetJ1_1: main (5 pins), resistors_set (R1.1 SB1.3)
NetJ3_1: main (5 pins), resistors_set (R14.2 SB8.4)
Relay1: resistors_set (U1.1), i2c_to_gpio (R33.1 U2.9)
Relay2: resistors_set (U1.2), i2c_to_gpio (R34.1 U2.10)
Relay3: resistors_set (U1.3), i2c_to_gpio (R35.1 U2.11)
Relay4: resistors_set (U1.4), i2c_to_gpio (R36.1 U2.12)
Relay5: resistors_set (U1.5), i2c_to_gpio (R32.1 U2.7)
Relay6: resistors_set (U1.6), i2c_to_gpio (R31.1 U2.6)
Relay7: resistors_set (U1.7), i2c_to_gpio (R30.1 U2.5)
Relay8: resistors_set (U1.8), i2c_to_gpio (R29.1 U2.4)
RXD: mcu (U3.24), usb_to_uart (R21.2)
SCL: mcu (J5.1 R17.2 R19.1), i2c_to_gpio (U2.14)
SDA: mcu (J5.2 R16.2 R18.1), i2c_to_gpio (U2.15)
TXD: mcu (U3.25), usb_to_uart (R20.2)
USB0_N: power (J6.2), usb_to_uart (U5.5)
USB0_P: power (J6.3), usb_to_uart (U5.4)

## Assembly variants
resistance_box_PCB_master: not fitted J1
resistance_box_PCB_middle: not fitted C5 C6 J2 U3 U4; alternate parts J3 -> soon, J4 -> PH-00068
resistance_box_PCB_bottom: not fitted C5 C6 J2 J3 U3 U4; alternate parts J1 -> soon, J4 -> PH-00068